# EAGLE design PCB_Draft_3 (EAGLE 9.6.2)
AUTHOR: R. Hall, A. Singh, K.Quizon; BOARD_NAME: ESP32 I2C Exp / M Driver; DOC_NUM: 0; PROJECT_NAME: R8-O7 PCB; REVISION: 5
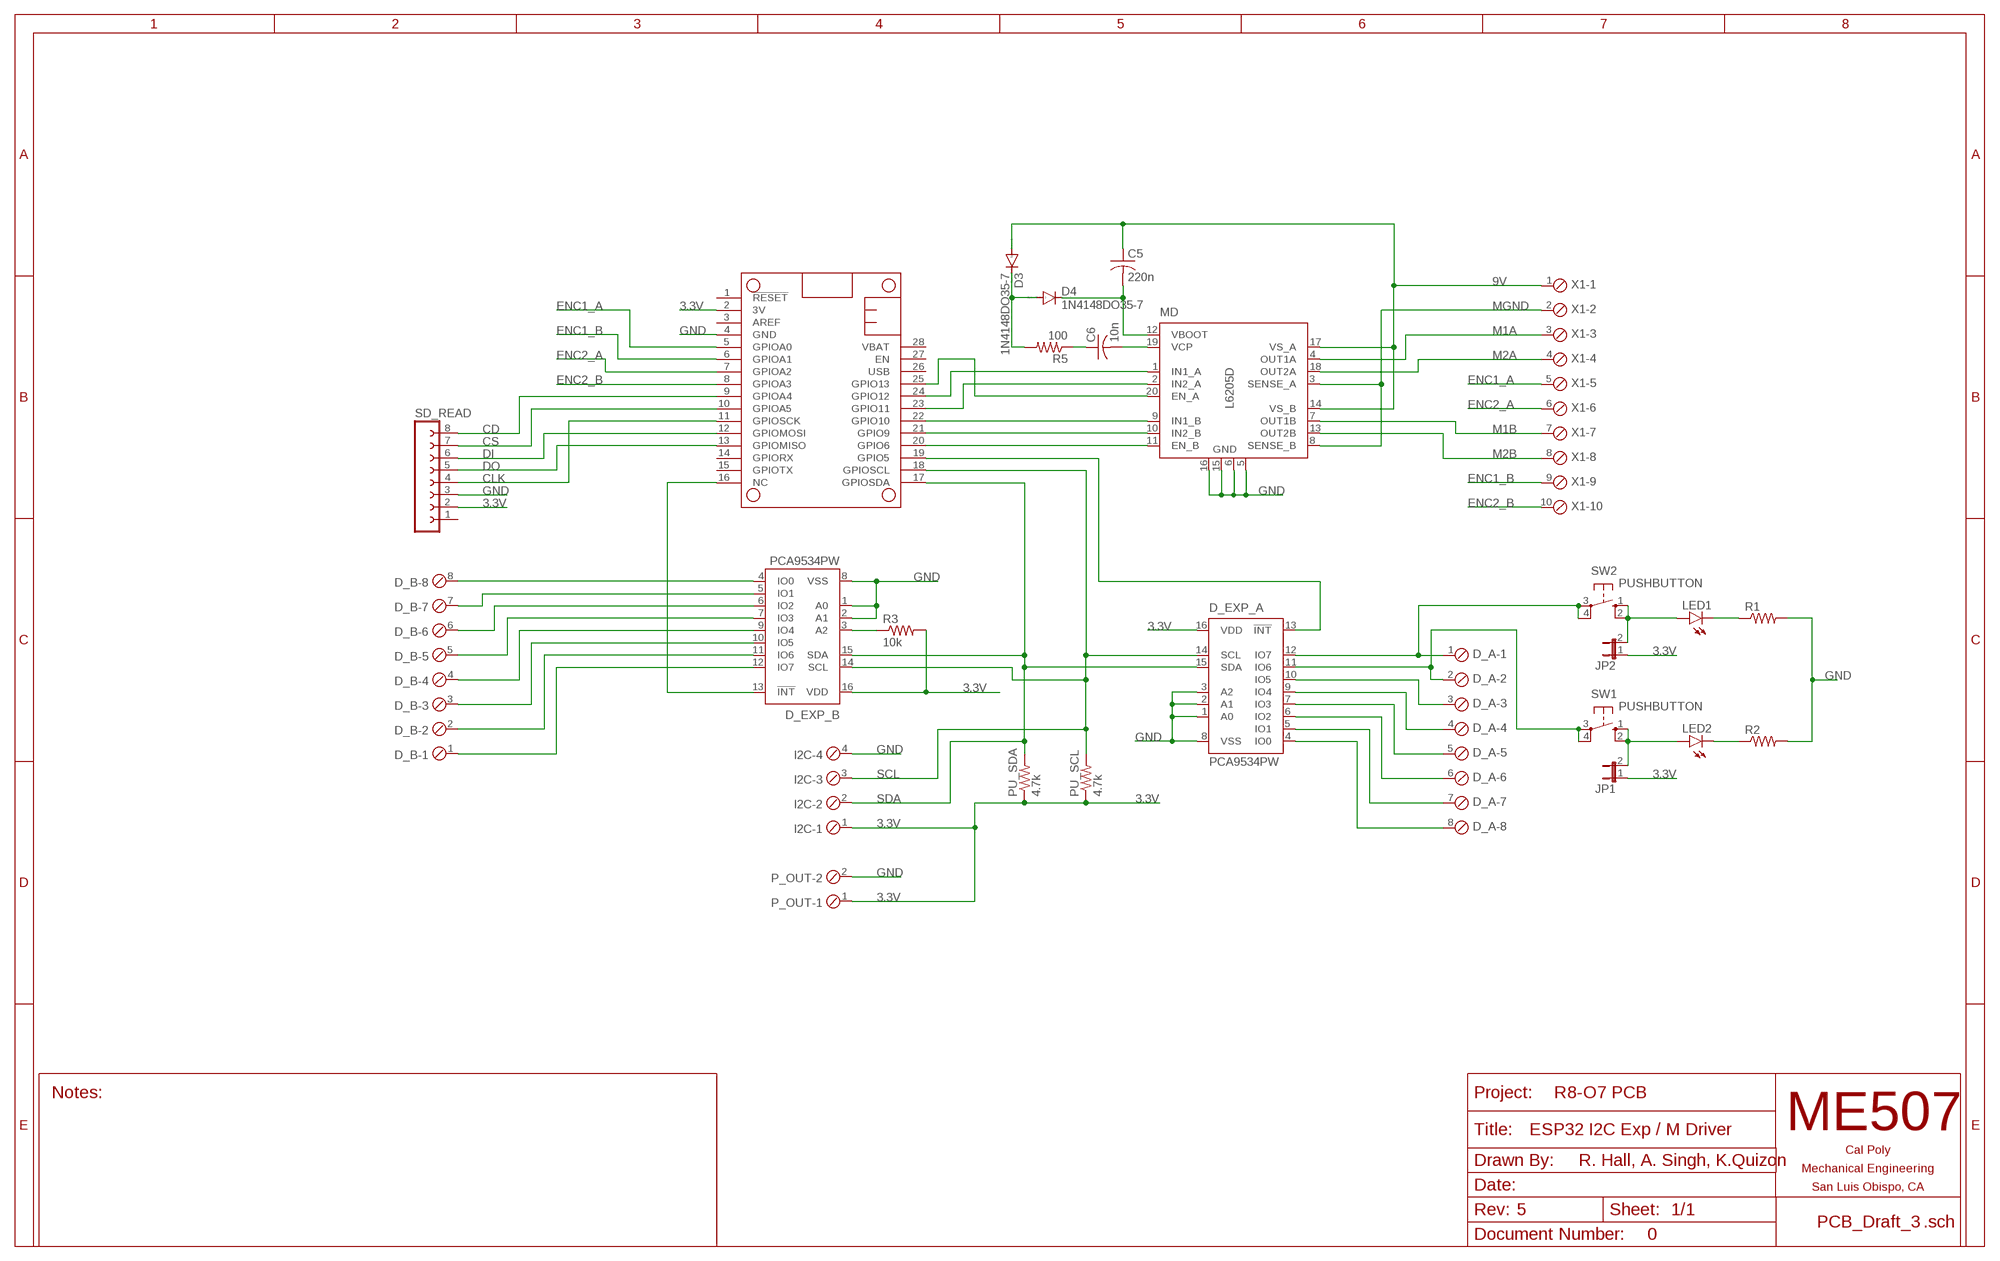
[diagram p0: schematic, sheet 1]

## Parts
C5  220n  C-USC0805  [C0805]
C6  10n  C-USC0805  [C0805]
D3  1N4148DO35-7  [DO35-7]
D4  1N4148DO35-7  [DO35-7]
D_A  SCREWTERM_8P_254  [8POL254]
D_B  SCREWTERM_8P_254  [8POL254]
D_EXP_A  PCA9534PW  [TSSOP16]
D_EXP_B  PCA9534PW  [TSSOP16]
FTHRWNG  FEATHERWINGEXTENDED_BOTH_ENDS  [FEATHERWING]
I2C  SCREWTERM_4P_254  [4POL254]
JP1  JP1E  [JP1]
JP2  JP1E  [JP1]
LED1  LEDCHIPLED_0805  [CHIPLED_0805]
LED2  LEDCHIPLED_0805  [CHIPLED_0805]
MD  L6205D  [SO20]
P_OUT  SCREWTERM_2P_254  [2POL254]
PU_SCL  4.7k  R-US_M0805  [M0805]
PU_SDA  4.7k  R-US_M0805  [M0805]
R1  R-US_M0805  [M0805]
R2  R-US_M0805  [M0805]
R3  10k  R-US_M0805  [M0805]
R5  100  R-US_M0805  [M0805]
SD_READ  FE08-1  [FE08]
SW1  PUSHBUTTON  [B3F-10XX]
SW2  PUSHBUTTON  [B3F-10XX]
X1  SCREWTERM_10P_254  [10POL254]

## Nets
3.3V: D_EXP_A.16(VDD) D_EXP_B.16(VDD) FTHRWNG.2(3V) I2C.1 JP1.1 JP2.1 P_OUT.1 PU_SCL.1 PU_SDA.1 R3.2 SD_READ.2
9V: C5.1 D3.A MD.14(VS_B) MD.17(VS_A) X1.1
CD: FTHRWNG.9(GPIOA4) SD_READ.8
CLK: FTHRWNG.11(GPIOSCK) SD_READ.4
CS: FTHRWNG.10(GPIOA5) SD_READ.7
DI: FTHRWNG.12(GPIOMOSI) SD_READ.6
DO: FTHRWNG.13(GPIOMISO) SD_READ.5
ENC1_A: FTHRWNG.5(GPIOA0) X1.5
ENC1_B: FTHRWNG.6(GPIOA1) X1.9
ENC2_A: FTHRWNG.7(GPIOA2) X1.6
ENC2_B: FTHRWNG.8(GPIOA3) X1.10
GND: D_EXP_A.1(A0) D_EXP_A.2(A1) D_EXP_A.3(A2) D_EXP_A.8(VSS) D_EXP_B.1(A0) D_EXP_B.2(A1) D_EXP_B.8(VSS) FTHRWNG.4(GND) I2C.4 MD.5(GND) MD.6(GND) MD.15(GND) MD.16(GND) P_OUT.2 R1.2 R2.2 SD_READ.3
M1A: MD.4(OUT1A) X1.3
M1B: MD.7(OUT1B) X1.7
M2A: MD.18(OUT2A) X1.4
M2B: MD.13(OUT2B) X1.8
MGND: MD.3(SENSE_A) MD.8(SENSE_B) X1.2
N$1: D_A.1 D_EXP_A.12(IO7) SW2.3(P) SW2.4(P1)
N$2: D_A.2 D_EXP_A.11(IO6) SW1.3(P) SW1.4(P1)
N$3: D_A.3 D_EXP_A.10(IO5)
N$4: D_A.4 D_EXP_A.9(IO4)
N$5: D_A.5 D_EXP_A.7(IO3)
N$6: D_A.6 D_EXP_A.6(IO2)
N$7: D_A.7 D_EXP_A.5(IO1)
N$8: D_A.8 D_EXP_A.4(IO0)
N$9: D_B.8 D_EXP_B.4(IO0)
N$10: D_B.7 D_EXP_B.5(IO1)
N$11: D_B.6 D_EXP_B.6(IO2)
N$12: D_B.5 D_EXP_B.7(IO3)
N$13: D_B.4 D_EXP_B.9(IO4)
N$14: D_B.3 D_EXP_B.10(IO5)
N$15: D_B.2 D_EXP_B.11(IO6)
N$16: D_B.1 D_EXP_B.12(IO7)
N$17: LED2.C R2.1
N$18: FTHRWNG.20(GPIO6) MD.11(EN_B)
N$19: D_EXP_A.13(!INT) FTHRWNG.19(GPIO5)
N$20: FTHRWNG.21(GPIO9) MD.10(IN2_B)
N$21: FTHRWNG.22(GPIO10) MD.9(IN1_B)
N$22: FTHRWNG.23(GPIO11) MD.2(IN2_A)
N$23: FTHRWNG.24(GPIO12) MD.1(IN1_A)
N$24: JP2.2 LED1.A SW2.1(S) SW2.2(S1)
N$25: FTHRWNG.25(GPIO13) MD.20(EN_A)
N$26: JP1.2 LED2.A SW1.1(S) SW1.2(S1)
N$27: D_EXP_B.13(!INT) FTHRWNG.16(NC)
N$28: LED1.C R1.1
N$29: D_EXP_B.3(A2) R3.1
N$43: C6.2 MD.19(VCP)
N$44: C6.1 R5.1
N$45: D3.C D4.A R5.2
N$46: C5.2 D4.C MD.12(VBOOT)
SCL: D_EXP_A.14(SCL) D_EXP_B.14(SCL) FTHRWNG.18(GPIOSCL) I2C.3 PU_SCL.2
SDA: D_EXP_A.15(SDA) D_EXP_B.15(SDA) FTHRWNG.17(GPIOSDA) I2C.2 PU_SDA.2
Unconnected: FTHRWNG.1(!RESET) FTHRWNG.3(AREF) FTHRWNG.14(GPIORX) FTHRWNG.15(GPIOTX) FTHRWNG.26(USB) FTHRWNG.27(EN) FTHRWNG.28(VBAT) SD_READ.1

## Library data of the parts
C5 C6 = rcl:C-US: CAPACITOR, American symbol; SPICEPREFIX: C
D3 D4 = diode:1N4148: DIODE high speed (Philips)
D_A D_B = ME507:SCREWTERM_8P: Screw Terminal Block This part is designed for a screw terminal connector. The 2.54mm (0.100 inch) foorprint can also be used for male or female pin headers such as those on most development boards. One can also solder wires directly into the holes, though this makes modifications or repairs to the system more inconvenient. Larger versions can carry more current.
D_EXP_A D_EXP_B = micro-philips:PCA9534: 8-bit I2C-bus and SMBus low power I/O port with interrupt Source: www.nxp.com .. PCA9534_3.pdf; MPN: PCA9534PW; OC_FARNELL: 1408285; OC_NEWARK: 18M7516
FTHRWNG = ME507:FEATHERWING: AdaFruitTM Feather Wing A modified version of a Featherwing, the add-on board for an AdaFruit(tm) Feather development board. There is a standard size version which is the same size as the Feather board on which the microcontroller hangs out. There is also an extended version, with each and longer by a quarter inch to allow for connectors such as screw terminals which aren't hidden under another board if this wing isn't on the top of the board stack. The pins are named in a generic fashion; these names do not necessarily correspond to Arduino or Python pin numbers. The designer must refer to the pinout diagram for each specific Feather board to find the functions of each pin.
I2C = ME507:SCREWTERM_4P: Screw Terminal Block This part is designed for a screw terminal connector. The 2.54mm (0.100 inch) foorprint can also be used for male or female pin headers such as those on most development boards. One can also solder wires directly into the holes, though this makes modifications or repairs to the system more inconvenient. Larger versions can carry more current.
JP1 JP2 = jumper:JP1E: JUMPER
LED1 LED2 = led:LED: LED OSRAM: - CHIPLED LG R971, LG N971, LY N971, LG Q971, LY Q971, LO R971, LY R971 LH N974, LH R974 LS Q976, LO Q976, LY Q976 LO Q996 - Hyper CHIPLED LW Q18S LB Q993, LB Q99A, LB R99A - SideLED LS A670, LO A670, LY A670, LG A670, LP A670 LB A673, LV A673, LT A673, LW A673 LH A674 LY A675 LS A676, LA A676, LO A676, LY A676, LW A676 LS A679, LY A679, LG A679 - Hyper Micro SIDELED® LS Y876, LA Y876, LO Y876, LY Y876 LT Y87S - SmartLED LW L88C, LW L88S LB L89C, LB L89S, LG L890 LS L89K, LO L89K, LY L89K LS L896, LA L896, LO L896, LY L896 - TOPLED LS T670, LO T670, LY T670, LG T670, LP T670 LSG T670, LSP T670, LSY T670, LOP T670, LYG T670 LG T671, LOG T671, LSG T671 LB T673, LV T673, LT T673, LW T673 LH T674 LS T676, LA T676, LO T676, LY T676, LB T676, LH T676, LSB T676, LW T676 LB T67C, LV T67C, LT T67C, LS T67K, LO T67K, LY T67K, LW E67C LS E67B, LA E67B, LO E67B, LY E67B, LB E67C, LV E67C, LT E67C LW T67C LS T679, LY T679, LG T679 LS T770, LO T770, LY T770, LG T770, LP T770 LB T773, LV T773, LT T773, LW T773 LH T774 LS E675, LA E675, LY E675, LS T675 LS T776, LA T776, LO T776, LY T776, LB T776 LHGB T686 LT T68C, LB T68C - Hyper Mini TOPLED® LB M676 - Mini TOPLED Santana® LG M470 LS M47K, LO M47K, LY M47K Source: http://www.osram.convergy.de LUXEON: - LUMILED® LXK2-PW12-R00, LXK2-PW12-S00, LXK2-PW14-U00, LXK2-PW14-V00 LXK2-PM12-R00, LXK2-PM12-S00, LXK2-PM14-U00 LXK2-PE12-Q00, LXK2-PE12-R00, LXK2-PE12-S00, LXK2-PE14-T00, LXK2-PE14-U00 LXK2-PB12-K00, LXK2-PB12-L00, LXK2-PB12-M00, LXK2-PB14-N00, LXK2-PB14-P00, LXK2-PB14-Q00 LXK2-PR12-L00, LXK2-PR12-M00, LXK2-PR14-Q00, LXK2-PR14-R00 LXK2-PD12-Q00, LXK2-PD12-R00, LXK2-PD12-S00 LXK2-PH12-R00, LXK2-PH12-S00 LXK2-PL12-P00, LXK2-PL12-Q00, LXK2-PL12-R00 Source: www.luxeon.com KINGBRIGHT: KA-3528ASYC Source: www.kingbright.com
MD = st-microelectronics:L6205: DUAL DMOS FULL BRIDGE MOTOR DRIVER; MPN: L6205D; OC_FARNELL: unknown; OC_NEWARK: 37M3487
P_OUT = ME507:SCREWTERM_2P: Screw Terminal Block This part is designed for a screw terminal connector. The 2.54mm (0.100 inch) foorprint can also be used for male or female pin headers such as those on most development boards. One can also solder wires directly into the holes, though this makes modifications or repairs to the system more inconvenient. Larger versions can carry more current.
PU_SCL PU_SDA R1-R3 R5 = rcl:R-US_: RESISTOR, American symbol; SPICEPREFIX: R
SD_READ = con-lsta:FE08-1: FEMALE HEADER; OC_FARNELL: unknown; OC_NEWARK: unknown
SW1 SW2 = ME507:PUSHBUTTON: OMRON SWITCH; MPN: B3F-1000; OC_FARNELL: 176432; OC_NEWARK: 36M3542
X1 = ME507:SCREWTERM_10P: Screw Terminal Block This part is designed for a screw terminal connector. The 2.54mm (0.100 inch) foorprint can also be used for male or female pin headers such as those on most development boards. One can also solder wires directly into the holes, though this makes modifications or repairs to the system more inconvenient. Larger versions can carry more current.

## Board
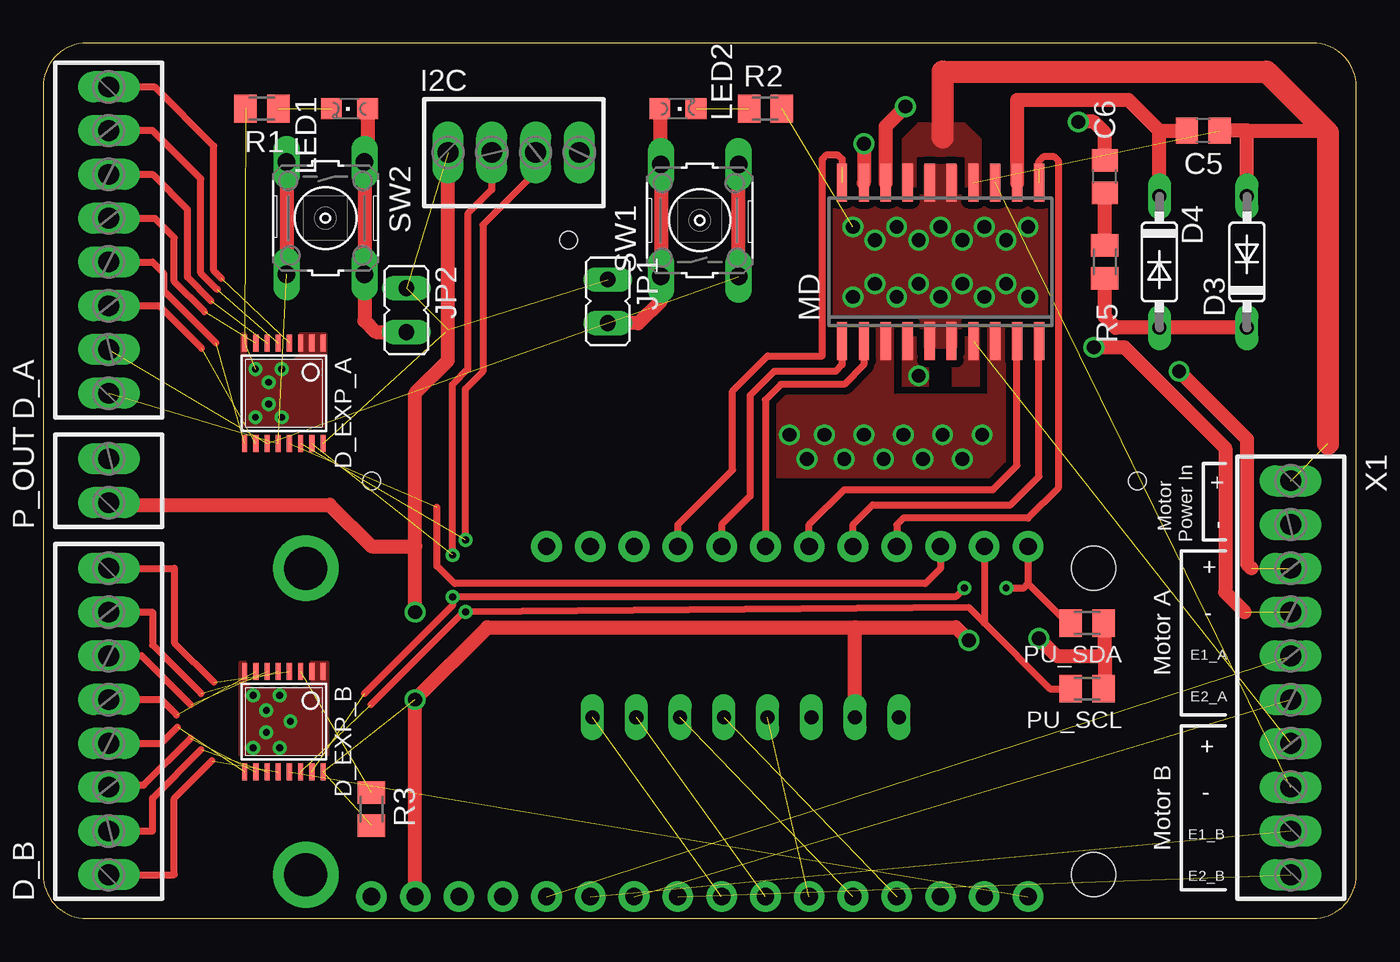
[diagram p1: board, top side]
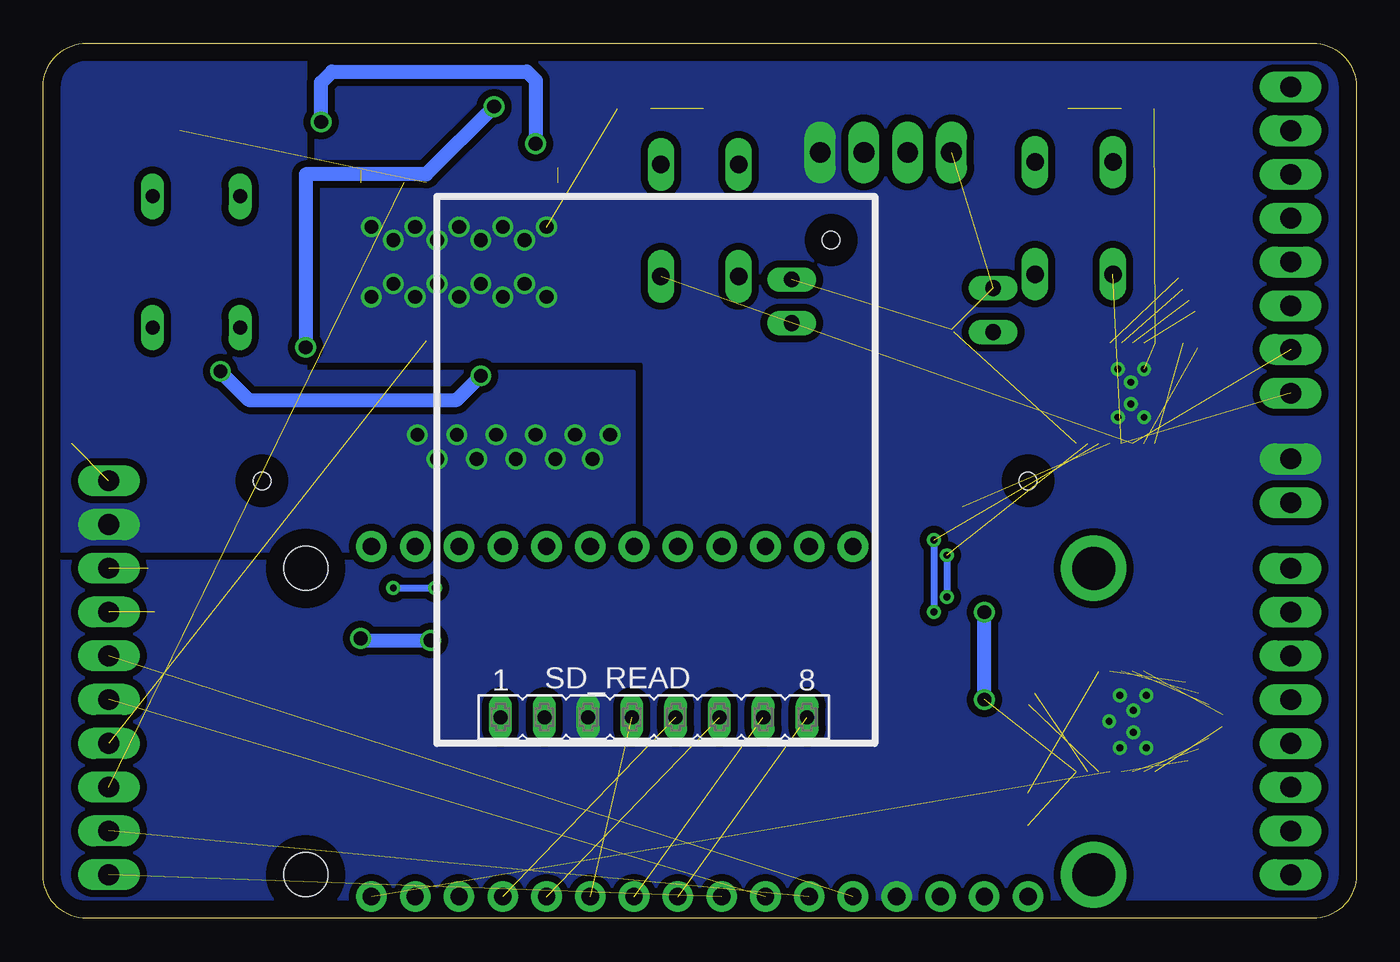
[diagram p2: board, bottom side, seen from below]

Size 76.2 x 50.8 mm. Coordinates in mm from the lower left corner, seen from the top.
Copper layers (1*16): Top 0.035mm / dielectric 1.5mm / Bottom 0.035mm
Design rules "default": minimum track width 6mil, minimum drill 0.35mm, track to track 6mil, track to pad 6mil, pad to pad 6mil, via to via 6mil, smd to smd 6mil, copper to edge 40mil, drill to drill 6mil, minimum pad ring 10mil, minimum via ring 8mil, stop-mask expansion 4mil, vias tented up to drill 0mil, thermal gap 10mil
Holes 1 mm at 30.48,39.37 19.05,25.4 63.5,25.4

### Footprints (pad centres in the part's own frame; a part is rotated, then mirrored left to right if it is on the bottom)
C0805 = smd 1.3 x 1.5: 1 -0.95,0; 2 0.95,0
DO35-7 = drill 0.813 long: A 3.81,0; C -3.81,0
8POL254 = drill 1.2 long: 1 -8.89,0; 2 -6.35,0; 3 -3.81,0; 4 -1.27,0; 5 1.27,0; 6 3.81,0; 7 6.35,0; 8 8.89,0
TSSOP16 = smd 0.305 x 0.991: 1 -2.275,-2.918; 2 -1.625,-2.918; 3 -0.975,-2.918; 4 -0.325,-2.918; 5 0.325,-2.918; 6 0.975,-2.918; 7 1.625,-2.918; 8 2.275,-2.918; 9 2.275,2.918; 10 1.625,2.918; 11 0.975,2.918; 12 0.325,2.918; 13 -0.325,2.918; 14 -0.975,2.918; 15 -1.625,2.918; 16 -2.275,2.918
FEATHERWING = drill 1 pad 1.778: 1 6.35,1.27; 2 8.89,1.27; 3 11.43,1.27; 4 13.97,1.27; 5 16.51,1.27; 6 19.05,1.27; 7 21.59,1.27; 8 24.13,1.27; 9 26.67,1.27; 10 29.21,1.27; 11 31.75,1.27; 12 34.29,1.27; 13 36.83,1.27; 14 39.37,1.27; 15 41.91,1.27; 16 44.45,1.27; 17 44.45,21.59; 18 41.91,21.59; 19 39.37,21.59; 20 36.83,21.59; 21 34.29,21.59; 22 31.75,21.59; 23 29.21,21.59; 24 26.67,21.59; 25 24.13,21.59; 26 21.59,21.59; 27 19.05,21.59; 28 16.51,21.59 | drill 2.5 pad 3.81: P$1 2.54,20.32; P$2 2.54,2.54 | hole 2.54: 48.26,20.32; 48.26,2.54
4POL254 = drill 1.2 long: 1 -3.81,0; 2 -1.27,0; 3 1.27,0; 4 3.81,0
JP1 = drill 0.914 long: 1 0,-1.27; 2 0,1.27
CHIPLED_0805 = smd 1.2 x 1.2: A 0,-1.05; C 0,1.05
SO20 = smd 0.6 x 2.2: 1 -5.715,-4.6; 2 -4.445,-4.6; 3 -3.175,-4.6; 4 -1.905,-4.6; 5 -0.635,-4.6; 6 0.635,-4.6; 7 1.905,-4.6; 8 3.175,-4.6; 9 4.445,-4.6; 10 5.715,-4.6; 11 5.715,4.6; 12 4.445,4.6; 13 3.175,4.6; 14 1.905,4.6; 15 0.635,4.6; 16 -0.635,4.6; 17 -1.905,4.6; 18 -3.175,4.6; 19 -4.445,4.6; 20 -5.715,4.6
2POL254 = drill 1.2 long: 1 -1.27,0; 2 1.27,0
M0805 = smd 1.3 x 1.6: 1 -0.95,0; 2 0.95,0
FE08 = drill 0.813 long: 1 -8.89,0; 2 -6.35,0; 3 -3.81,0; 4 -1.27,0; 5 1.27,0; 6 3.81,0; 7 6.35,0; 8 8.89,0
B3F-10XX = drill 1.016 long: 1 -3.251,2.261; 2 3.251,2.261; 3 -3.251,-2.261; 4 3.251,-2.261
10POL254 = drill 1.2 long: 1 -11.43,0; 2 -8.89,0; 3 -6.35,0; 4 -3.81,0; 5 -1.27,0; 6 1.27,0; 7 3.81,0; 8 6.35,0; 9 8.89,0; 10 11.43,0

### Placement (x,y rotation side)
C5  67.31,45.72 180 top
C6  61.59,43.05 90 top
D3  69.85,38.1 90 top
D4  64.77,38.1 270 top
D_A  3.81,39.37 90 top
D_B  3.81,11.43 90 top
D_EXP_A  13.97,30.48 180 top
D_EXP_B  13.97,11.43 180 top
FTHRWNG  12.7,0 0 top
I2C  27.3,44.45 0 top
JP1  32.77,35.81 180 top
JP2  21.08,35.31 180 top
LED1  17.78,46.99 90 top
LED2  36.83,46.99 270 top
MD  52.07,38.1 0 top
P_OUT  3.81,25.4 90 top
PU_SCL  60.58,13.34 180 top
PU_SDA  60.58,17.14 180 top
R1  12.7,46.99 180 top
R2  41.91,46.99 0 top
R3  19.05,6.35 270 top
R5  61.59,38.1 270 top
SD_READ  40.77,11.68 0 bottom
SW1  38.1,40.51 90 top
SW2  16.38,40.64 270 top
X1  72.39,13.97 270 top

### Tracks (layer width: path | path; a pad name or v marks a point on that pad's centre or on a via)
3.3V  (via drill 0.8)  (6 unrouted)
  Top 0.406: 23.5,34.16 23.36,34.02
  Top 0.61: 61.85,13.34 PU_SCL.1
  Top 0.813: FTHRWNG.2 v21.59,12.7 25.78,16.89 47.12,16.89 | v53.72,16.13 52.96,16.89 47.12,16.89 | v21.59,17.78 21.59,21.59 | 21.59,21.59 21.59,30.48 23.5,32.38 I2C.1 | P_OUT.1 3.94,24 16.64,24 19.05,21.59 21.59,21.59 | SD_READ.2 47.12,16.89 | 61.78,13.59 PU_SCL.1 61.59,13.4 61.59,15.24 | v57.78,16.26 58.8,15.24 61.59,15.24 | 61.59,15.24 61.59,17.08 PU_SDA.1
  Bottom 0.813: v21.59,12.7 v21.59,17.78 | v57.78,16.26 57.66,16.13 v53.72,16.13
9V  (2 unrouted)
  Top 0.813: D3.A 69.85,45.72 | 69.85,45.72 C5.1 | 69.85,45.72 74.42,45.72
  Top 1.27: 52.2,45.34 52.2,49.15 70.99,49.15 74.55,45.59 74.55,27.56
  pour Top (isolate 0.406, rank 6, no thermals): 49.91,41.27 54.36,41.27 54.36,45.21 53.47,46.1 50.8,46.1 49.91,45.21
CD  (1 unrouted)
CLK  (1 unrouted)
CS  (1 unrouted)
DI  (1 unrouted)
DO  (1 unrouted)
ENC1_A  (1 unrouted)
ENC1_B  (1 unrouted)
ENC2_A  (1 unrouted)
ENC2_B  (1 unrouted)
GND  (via drill 0.4, 0.8)  (3 unrouted)
  other vias: 46.99,40.13 48.26,39.37 49.53,40.13 50.8,39.37 52.07,40.13 53.34,39.37 54.61,40.13 55.88,39.37 57.15,40.13 57.15,36.07 55.88,36.83 54.61,36.07 53.34,36.83 52.07,36.07 50.8,36.83 49.53,36.07 48.26,36.83 46.99,36.07 13.84,29.08 13.08,29.84 12.32,29.08 13.08,31.11 12.32,31.88 13.84,31.88 12.95,12.06 12.19,12.95 12.19,9.91 14.35,11.43 12.95,10.79 13.72,9.91 13.72,12.95
  pour Bottom (isolate 0.406, rank 6, no thermals): 0,50.8 0,0 76.2,0 76.2,50.8
  pour Top (isolate 0.406, no thermals): 45.72,41.91 51.18,41.91 51.18,43.69 52.96,43.69 52.96,41.91 58.42,41.91 58.42,34.29 52.96,34.29 52.96,33.15 51.18,33.15 51.18,34.29 45.72,34.29
  pour Top (isolate 0.406, no thermals): 11.56,33.91 16.38,33.91 16.38,27.05 11.56,27.05
  pour Top (isolate 0.406, no thermals): 11.43,14.86 16.51,14.86 16.51,8 11.43,8
M1A  (via drill 0.8)  (1 unrouted)
  Top 0.813: v65.91,31.75 69.85,27.81 69.85,20.57 70.1,20.32
  Bottom 0.813: v50.8,31.5 52.2,30.1 64.26,30.1 v65.91,31.75
  pour Top (isolate 0.406, rank 6, no thermals): 49.91,34.54 49.91,30.73 51.31,30.73 51.31,34.54
M1B  (1 unrouted)
  pour Top (isolate 0.406, rank 6, no thermals): 54.36,34.54 54.36,30.73 52.83,30.73 52.83,34.54
M2A  (via drill 0.8)  (1 unrouted)
  Top 0.813: MD.18 48.9,45.97 v50.04,47.12 | v60.96,33.15 62.74,33.15 68.58,27.3 68.58,18.92 69.72,17.78
  Bottom 0.813: v50.04,47.12 53.98,43.18 60.96,43.18 v60.96,33.15
M2B  (1 unrouted)
MGND  (via drill 0.8)
  other vias: 49.91,28.07 52.2,28.07 54.48,28.07 53.34,26.67 51.05,26.67 48.77,26.67 47.62,28.07 46.48,26.67 45.34,28.07 44.32,26.67 43.31,28.07
  pour Bottom (isolate 0.406, no thermals): 60.96,50.8 60.96,31.75 41.91,31.75 41.91,21.34 76.2,21.34 76.2,50.8
  pour Top (isolate 0.406, rank 4, no thermals): 48.13,34.67 49.28,34.67 49.28,30.35 54.86,30.35 54.86,34.54 56.13,34.54 56.13,26.42 55.37,25.65 41.91,25.65 41.91,31.75 48.13,31.75
N$1  (2 unrouted)
  Top 0.813: SW2.3 SW2.4
N$2  (2 unrouted)
  Top 0.813: SW1.3 SW1.4
N$3  (1 unrouted)
  Top 0.406: 9.2,33.09 6.73,35.56 D_A.3
N$4  (1 unrouted)
  Top 0.406: 10.03,33.4 6.99,36.45 6.99,37.47 6.35,38.1 D_A.4
N$5  (1 unrouted)
  Top 0.406: 9.37,35.2 7.62,36.96 7.62,39.5 6.48,40.64 D_A.5
N$6  (1 unrouted)
  Top 0.406: 9.74,35.85 8.38,37.21 8.38,41.15 6.35,43.18 D_A.6
N$7  (1 unrouted)
  Top 0.406: 10.1,36.51 9.14,37.47 9.14,42.93 6.35,45.72 D_A.7
N$8  (1 unrouted)
  Top 0.406: 10.34,37.16 9.91,37.59 9.91,44.83 6.48,48.26 D_A.8
N$9  (1 unrouted)
  Top 0.406: D_B.8 7.62,20.32 7.62,16 9.92,13.71
N$10  (1 unrouted)
  Top 0.406: D_B.7 6.35,17.78 6.35,15.88 9.17,13.05
N$11  (1 unrouted)
  Top 0.406: D_B.6 5.71,15.24 8.55,12.4
N$12  (1 unrouted)
  Top 0.406: D_B.5 6.86,12.7 7.75,11.81
N$13  (1 unrouted)
  Top 0.406: D_B.4 6.86,10.16 7.8,11.11
N$14  (1 unrouted)
  Top 0.406: D_B.3 3.94,7.75 5.84,7.75 8.55,10.46
N$15  (1 unrouted)
  Top 0.406: D_B.2 6.35,5.08 6.35,6.99 9.17,9.8
N$16  (1 unrouted)
  Top 0.406: D_B.1 7.62,2.54 7.62,6.99 9.79,9.15
N$17  (1 unrouted)
N$18  (1 unrouted)
  Top 0.406: 57.78,43.43 57.78,43.94 58.04,44.2 58.67,44.2 58.93,43.94 58.93,25.02 57.15,23.24 49.91,23.24 49.53,22.86 FTHRWNG.20
N$19  (1 unrouted)
  Top 0.406: FTHRWNG.19 52.07,20.32 51.18,19.43 23.88,19.43 22.86,20.45 22.86,23.88
N$20
  Top 0.406: FTHRWNG.21 46.99,22.86 48.13,24 56.13,24 57.78,25.65 MD.10
N$21
  Top 0.406: FTHRWNG.22 44.45,22.86 46.48,24.89 55.12,24.89 56.52,26.29 MD.9
N$22
  Top 0.406: MD.2 47.62,32.13 46.48,30.99 42.8,30.99 41.91,30.1 FTHRWNG.23
N$23
  Top 0.406: FTHRWNG.24 39.37,22.86 41.02,24.51 41.02,30.35 42.42,31.75 45.97,31.75 46.35,32.13 MD.1
N$24
  Top 0.813: JP2.2 19.3,34.04 18.64,34.7 SW2.2 SW2.1 18.83,44.08 LED1.A
N$25  (1 unrouted)
  Top 0.406: 46.35,43.56 46.35,44.07 46.1,44.32 45.47,44.32 45.21,44.07 45.21,32.64 42.04,32.64 40.01,30.61 40.01,26.04 36.83,22.86 FTHRWNG.25
N$26
  Top 0.813: JP1.2 34.54,34.54 35.84,35.84 SW1.1 SW1.2 35.78,43.82 LED2.A
N$27  (1 unrouted)
N$28  (1 unrouted)
N$29  (1 unrouted)
N$43  (via drill 0.8)
  Top 0.813: v47.62,44.96 MD.19 | C6.2 61.59,45.59 60.96,46.23 v60.07,46.23
  Bottom 0.813: v60.07,46.23 60.07,48.51 59.44,49.15 48.13,49.15 47.62,48.64 v47.62,44.96
N$44
  Top 0.813: R5.1 C6.1
N$45
  Top 0.813: D3.C D4.A 62.23,34.29 61.59,34.92 R5.2
N$46
  Top 0.813: D4.C 64.77,45.72 | 64.77,45.72 C5.2 | 64.77,45.72 62.99,47.5 56.52,47.5 MD.12
SCL  (via drill 0.4)  (2 unrouted)
  Top 0.406: 54.61,17.14 58.42,13.34 PU_SCL.2 | FTHRWNG.18 54.61,17.14 | 19.01,12.4 24.38,17.78 v24.51,17.78 53.71,18.04 54.61,17.14 | v24.51,21.97 24.51,30.73 25.53,31.75 25.53,40.26 28.57,43.31 I2C.3
  Bottom 0.406: v24.51,21.97 v24.51,17.78
SDA  (via drill 0.4)  (2 unrouted)
  Top 0.406: FTHRWNG.17 57.15,19.43 | 57.15,19.43 59.44,17.14 PU_SDA.2 | 18.64,13.05 23.75,18.16 v23.75,18.67 52.96,18.67 v53.47,19.18 | v23.75,21.08 23.75,30.99 24.64,31.88 24.64,40.89 26.04,42.29 I2C.2 | v55.88,19.18 56.9,19.18 57.15,19.43
  Bottom 0.406: v55.88,19.18 v53.47,19.18 | v23.75,21.08 v23.75,18.67

### Text on the board
tPlace: Motor / Power In | Motor A | Motor B
tNames: + | - | + | - | E1_A | E2_A | + | - | E1_B | E2_B